# Altium schematic sheet carte_ninja2026.SchDoc
size A4; SheetNumber: 1; SheetTotal: 1
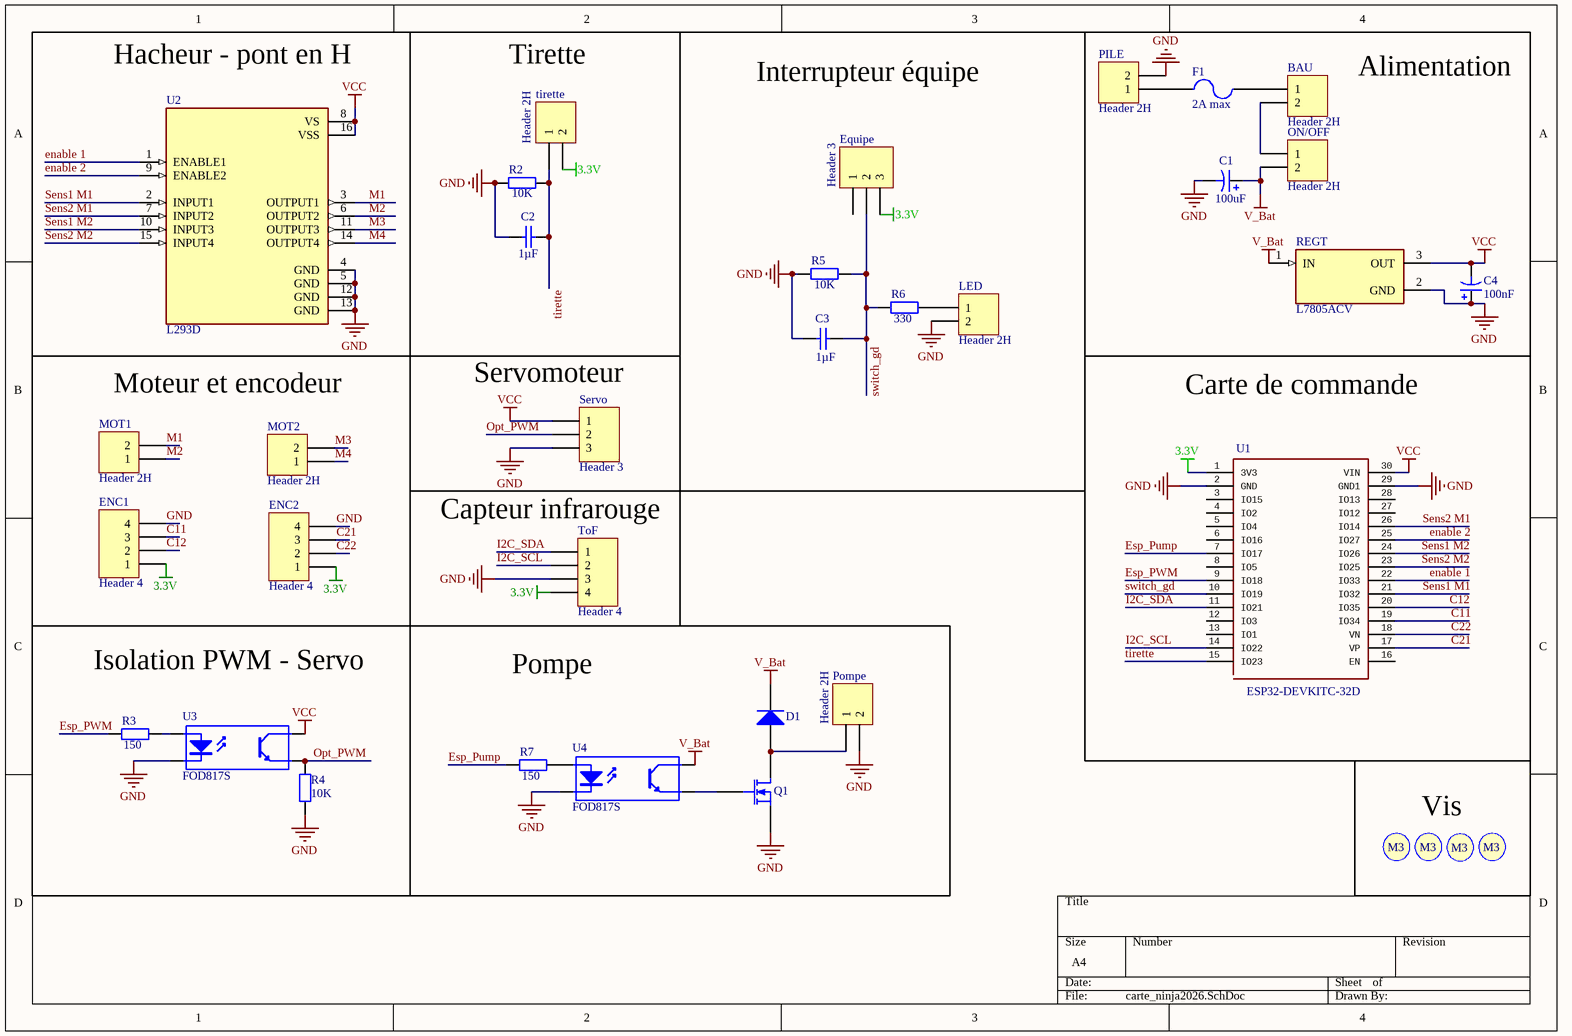
[diagram p0: carte_ninja2026.SchDoc]

## Parts
BAU  Header 2H  [JST_B2B-XH-A_(LF)(SN)]
C1  value 100uF  [Condensateur]  (hidden comment: 35V)
C2  value 1µF  [Capacitor 1206]  (hidden comment: Cap)
C3  value 1µF  [Capacitor 1206]  (hidden comment: Cap)
C4  value 100nF  [Condensateur]  (hidden comment: 35V)
D1  LGE SS12  [SMB]  (value not drawn)
ENC1  Header 4  [B4BXHALFSN]
ENC2  Header 4  [B4BXHALFSN]
Equipe  Header 3  [JST_B3B-XH-A(LF)(SN)]
F1  2A max  [Fuse]
LED  Header 2H  [JST_B2B-XH-A_(LF)(SN)]
MOT1  Header 2H  [JST_B2B-XH-A_(LF)(SN)]
MOT2  Header 2H  [JST_B2B-XH-A_(LF)(SN)]
ON/OFF  Header 2H  [JST_B2B-XH-A_(LF)(SN)]
PILE  Header 2H  [JST_B2B-XH-A_(LF)(SN)]
Pompe  Header 2H  [JST_B2B-XH-A_(LF)(SN)]
Q1  MOSFET-N  [SOT23_M]  (value not drawn)
R2  value 10K  [Resistor 1206]  (hidden comment: Res2)
R3  value 150  [Resistor 1206]  (hidden comment: Res2)
R4  value 10K  [Resistor 1206]  (hidden comment: Res2)
R5  value 10K  [Resistor 1206]  (hidden comment: Res2)
R6  value 330  [Resistor 1206]  (hidden comment: Res2)
R7  value 150  [Resistor 1206]  (hidden comment: Res2)
REGT  L7805ACV  [TO254P460X1020X1945-3P]
S0  Screw M3  [Screw M3]  (value not drawn)
S1  Screw M3  [Screw M3]  (value not drawn)
S2  Screw M3  [Screw M3]  (value not drawn)
S3  Screw M3  [Screw M3]  (value not drawn)
Servo  Header 3  [JST_B3B-XH-A(LF)(SN)]
tirette  Header 2H  [JST_B2B-XH-A_(LF)(SN)]
ToF  Header 4  [B4BXHALFSN]
U1  ESP32-DEVKITC-32D  [MODULE_ESP32-DEVKITV1]
U2  L293D  [DIP880W50P254L2000H510Q16]
U3  FOD817S  [SOP254P1016X385-4N]
U4  FOD817S  [SOP254P1016X385-4N]

## Blocks framed on the sheet
Hacheur - pont en H: U2
Tirette: C2 R2 tirette
Interrupteur équipe: C3 Equipe LED R5 R6
Alimentation: BAU C1 C4 F1 ON/OFF PILE REGT
Moteur et encodeur: ENC1 ENC2 MOT1 MOT2
Servomoteur: Servo
Carte de commande: U1
Capteur infrarouge: ToF
Isolation PWM - Servo: R3 R4 U3
Pompe: D1 Pompe Q1 R7 U4
Vis: S0-S3

## Nets
3.3V: ENC1.1 ENC2.1 Equipe.3 tirette.2 ToF.4 U1.1(3V3)
GND: C1.2 C2.1 C3.1 C4.1 ENC1.4 ENC2.4 LED.2 PILE.2 Pompe.2 Q1.3(S) R2.1 R4.1 R5.1 REGT.2(GND) Servo.3 ToF.3 U1.2(GND) U1.29(GND1) U2.4(GND) U2.5(GND) U2.12(GND) U2.13(GND) U3.2(K) U4.2(K)
V_Bat: C1.1 D1.2(K) ON/OFF.2 REGT.1(IN) U4.4(C)
VCC: C4.2 REGT.3(OUT) Servo.1 U1.30(VIN) U2.8(VS) U2.16(VSS) U3.4(C)
C11: ENC1.3 U1.19(IO34)
C12: ENC1.2 U1.20(IO35)
C21: ENC2.3 U1.17(VP)
C22: ENC2.2 U1.18(VN)
enable 1: U1.22(IO33) U2.1(ENABLE1)
enable 2: U1.25(IO27) U2.9(ENABLE2)
Esp_Pump: R7.1 U1.7(IO17)
Esp_PWM: R3.1 U1.9(IO18)
I2C_SCL: ToF.2 U1.14(IO22)
I2C_SDA: ToF.1 U1.11(IO21)
M1: MOT1.2 U2.3(OUTPUT1)
M2: MOT1.1 U2.6(OUTPUT2)
M3: MOT2.2 U2.11(OUTPUT3)
M4: MOT2.1 U2.14(OUTPUT4)
Opt_PWM: R4.2 Servo.2 U3.3(E)
Sens1 M1: U1.21(IO32) U2.2(INPUT1)
Sens1 M2: U1.24(IO26) U2.10(INPUT3)
Sens2 M1: U1.26(IO14) U2.7(INPUT2)
Sens2 M2: U1.23(IO25) U2.15(INPUT4)
switch_gd: C3.2 Equipe.2 R5.2 R6.1 U1.10(IO19)
tirette: C2.2 R2.2 tirette.1 U1.15(IO23)
NetBAU_1: BAU.1 F1.1
NetBAU_2: BAU.2 ON/OFF.1
NetD1_1: D1.1(A) Pompe.1 Q1.1(D)
NetF1_2: F1.2 PILE.1
NetLED_1: LED.1 R6.2
NetQ1_2: Q1.2(G) U4.3(E)
NetR3_2: R3.2 U3.1(A)
NetR7_2: R7.2 U4.1(A)

Not connected (* = marked no-connect by the designer): Equipe 1; U1 3(IO15) 4(IO2) 5(IO4) 6(IO16) 8(IO5) 12(IO3) 13(IO1) 16(EN) 27(IO12) 28(IO13)

## Notes on the sheet
- (in symbol Screw M3) M3

## Library data of the parts
BAU LED MOT1 MOT2 ON/OFF PILE Pompe tirette = Header 2H: Header, 2-Pin, Right Angle; LatestRevisionDate: 17-Jul-2002; LatestRevisionNote: Re-released for DXP Platform.; Publisher: Altium Limited
C1 C4 = Cap Pol1: Polarized Capacitor (Radial); Published: 8-Jun-2000; LatestRevisionDate: 17-Jul-2002; LatestRevisionNote: Re-released for DXP Platform.; PackageReference: RB7.6-15; Publisher: Altium Limited; PackageDescription: Polarized Capacitor (Radial); 2 Leads
C2 C3 = Cap: Capacitor; Published: 8-Jun-2000; LatestRevisionDate: 17-Jul-2002; LatestRevisionNote: Re-released for DXP Platform.; PackageReference: RAD-0.3; Publisher: Altium Limited; PackageDescription: Radial Cap, Thru-Hole; 2 Leads; 0.3 in Pin Spacing
D1 = Diode: Default Diode; Published: 8-Jun-2000; LatestRevisionDate: 17-Jul-2002; LatestRevisionNote: Re-released for DXP Platform.; PackageVersion: Sep-1996; PackageReference: SMC; Publisher: Altium Limited; PackageDescription: DO-214-AB/SMC; 2 C-Bend Leads; Body 7.9 x 5.9 mm, inc. leads (LxW); Code_JEDEC: DO-214-AB
ENC1 ENC2 ToF = Header 4: Header, 4-Pin; LatestRevisionDate: 17-Jul-2002; LatestRevisionNote: Re-released for DXP Platform.; Publisher: Altium Limited
Equipe Servo = Header 3: Header, 3-Pin; LatestRevisionDate: 17-Jul-2002; LatestRevisionNote: Re-released for DXP Platform.; Publisher: Altium Limited
F1 = Fuse 2: Main Fuse; Published: 8-Jun-2000; LatestRevisionDate: 17-Jul-2002; LatestRevisionNote: Re-released for DXP Platform.; PackageReference: PIN-W2/E2.8; Publisher: Altium Limited; PackageDescription: Thru-Hole; 2 Leads
Q1 = MOSFET-N: N-Channel MOSFET; pin to pad: 2>3 3>2; Published: 8-Jun-2000; LatestRevisionDate: 17-Jul-2002; LatestRevisionNote: Re-released for DXP Platform.; PackageVersion: 1995/1996; PackageReference: E3; Publisher: Altium Limited; PackageDescription: TO, Flat Index; 3 In-Line, Axial Leads; Body Dia. 4.6mm; Lead Dia. 0.5 mm (max)
R2-R7 = Res2: Resistor; Published: 8-Jun-2000; LatestRevisionDate: 17-Jul-2002; LatestRevisionNote: Re-released for DXP Platform.; PackageReference: AXIAL-0.4; Publisher: Altium Limited; PackageDescription: Axial Device, Thru-Hole; 2 Leads; 0.4 in Pin Spacing
REGT = L7805ACV: Linear Voltage Regulator IC Positive Fixed 1 Output 1.5A TO-220; MF: STMicroelectronics; SnapEDA_Link: https://www.snapeda.com/parts/L7805ACV/STMicroelectronics/view-part/?ref=snap; Package: TO-220-3 STMicroelectronics; Value: *; MP: L7805ACV; Check_prices: https://www.snapeda.com/parts/L7805ACV/STMicroelectronics/view-part/?ref=eda
U1 = ESP32-DEVKITC-32D: Eval Board For Esp-Wroom-32; MF: Espressif Systems; Availability: Unavailable; Package: None; SnapEDA_Link: https://www.snapeda.com/parts/ESP32-DEVKITC-32D/Espressif%20Systems/view-part/?ref=snap; MP: ESP32-DEVKITC-32D; Price: None; Value: *
U2 = L293D: Bipolar Motor Driver - Parallel 16-PowerDIP; MF: STMicroelectronics; MP: L293D; Package: DIP-16 STMicroelectronics; SnapEDA_Link: https://www.snapeda.com/parts/L293D/STMicroelectronics/view-part/?ref=snap; Purchase-URL: https://pricing.snapeda.com/search/part/L293D/?ref=eda; Check_prices: https://www.snapeda.com/parts/L293D/STMicroelectronics/view-part/?ref=eda; Availability: In Stock; Value: *; Price: None
U3 U4 = Optoisolator1: 4-Pin Phototransistor Optocoupler; Published: 24-Mar-1999; LatestRevisionDate: 04-Mar-2005; LatestRevisionNote: Sch pins 3 & 4 Swapped.; DatasheetVersion: Nov-2003; PackageReference: DIP-4; Publisher: Altium Limited